# Altium schematic sheet Controller.SchDoc
size A4; SheetNumber: 3; SheetTotal: 5
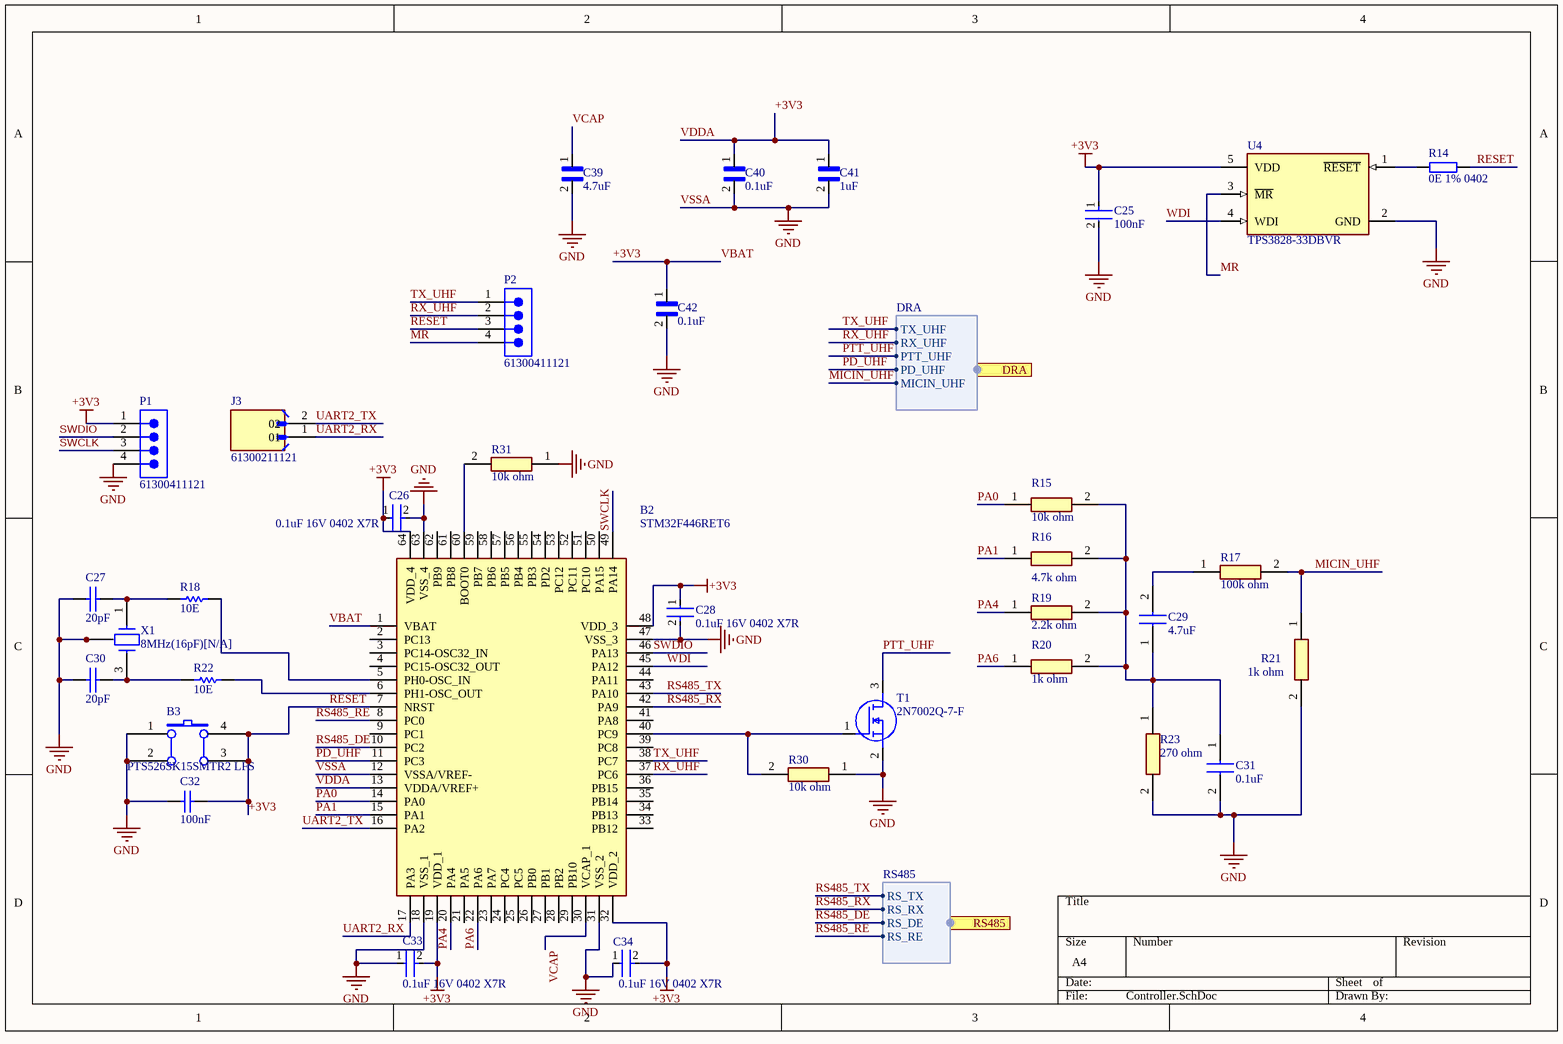
[diagram p0: Controller.SchDoc]

## Parts
B2  STM32F446RET6  [LQFP64]
B3  PTS526SK15SMTR2 LFS  [PTS526SK15SMTR2 LFS]
C25  100nF  [CAP0402S]
C26  0.1uF 16V 0402 X7R  [CAP0402S]
C27  20pF  [C0201]
C28  0.1uF 16V 0402 X7R  [CAP0402S]
C29  4.7uF  [CAP0603S]
C30  20pF  [C0201]
C31  0.1uF  [CAP0603S]
C32  100nF  [CAP0603S]
C33  0.1uF 16V 0402 X7R  [CAP0402S]
C34  0.1uF 16V 0402 X7R  [CAP0402S]
C39  4.7uF  [CAP0603S]
C40  0.1uF  [CAP0603S]
C41  1uF  [CAP0603S]
C42  0.1uF  [CAP0603S]
J3  61300211121  [HDR_P2.54_2X1_VERTICAL_TH]
P1  61300411121  [HDR_P2.0_4X1_VERTICAL_TH]
P2  61300411121  [HDR_P2.0_4X1_VERTICAL_TH]
R14  0E 1% 0402  [RES0402S]
R15  10k ohm  [RES0603S]
R16  4.7k ohm  [RES0603S]
R17  100k ohm  [RES0603S]
R18  10E  [RES0603S]
R19  2.2k ohm  [RES0603S]
R20  1k ohm  [RES0603S]
R21  1k ohm  [RES0603S]
R22  10E  [RES0603S]
R23  270 ohm  [RES0603S]
R30  10k ohm  [RES0603S]
R31  10k ohm  [RES0603S]
T1  2N7002Q-7-F  [SOT23_3]
U4  TPS3828-33DBVR  [SOT23-5]
X1  8MHz(16pF)[N/A]  [WE-XTAL_CFPX-104]

## Ports
DRA (harness DRA), RS485 (harness RS485)

## Harnesses
RS485: RS_TX, RS_RX, RS_DE, RS_RE
DRA: TX_UHF, RX_UHF, PTT_UHF, PD_UHF, MICIN_UHF

## Nets
+3V3: B2.1(VBAT) B2.7(NRST) B2.13(VDDA/VREF+) B2.19(VDD_1) B2.32(VDD_2) B2.48(VDD_3) B2.64(VDD_4) B3.3(B1) B3.4(A1) C25.1 C26.1 C28.1 C32.1 C33.2 C34.2 C40.1 C41.1 C42.1 P1.1 P2.3 R14.2 U4.5(VDD)  [also labelled RESET, VBAT, VDDA]
VSSA: B2.12(VSSA/VREF-) B2.18(VSS_1) B2.31(VSS_2) B2.47(VSS_3) B2.63(VSS_4) B3.1(A0) B3.2(B0) C25.2 C26.2 C27.2 C28.2 C30.2 C31.2 C32.2 C33.1 C34.1 C39.2 C40.2 C41.2 C42.2 P1.4 R21.2 R23.2 R30.1 R31.1 T1.2(S) U4.2(GND) X1.2 X1.4  [also labelled GND]
MICIN_UHF: R17.2 R21.1 ; port DRA.MICIN_UHF
MR: P2.4 U4.3(~{MR})
PA0: B2.14(PA0) R15.1
PA1: B2.15(PA1) R16.1
PA4: B2.20(PA4) R19.1
PA6: B2.22(PA6) R20.1
PD_UHF: B2.11(PC3) ; port DRA.PD_UHF
PTT_UHF: T1.3(D) ; port DRA.PTT_UHF
RS485_DE: B2.10(PC2) ; port RS485.RS_DE
RS485_RE: B2.8(PC0) ; port RS485.RS_RE
RS485_RX: B2.42(PA9) ; port RS485.RS_RX
RS485_TX: B2.43(PA10) ; port RS485.RS_TX
RX_UHF: B2.37(PC6) P2.2 ; port DRA.RX_UHF
SWCLK: B2.49(PA14) P1.3
SWDIO: B2.46(PA13) P1.2
TX_UHF: B2.38(PC7) P2.1 ; port DRA.TX_UHF
UART2_RX: B2.17(PA3) J3.1(01)
UART2_TX: B2.16(PA2) J3.2(02)
VCAP: B2.30(VCAP_1) C39.1
WDI: B2.45(PA12) U4.4(WDI)
NetB2_5: B2.5(PH0-OSC_IN) R18.1
NetB2_6: B2.6(PH1-OSC_OUT) R22.1
NetB2_40: B2.40(PC9) R30.2 T1.1(G)
NetB2_60: B2.60(BOOT0) R31.2
NetC27_1: C27.1 R18.2 X1.1
NetC29_1: C29.1 C31.1 R15.2 R16.2 R19.2 R20.2 R23.1
NetC29_2: C29.2 R17.1
NetC30_1: C30.1 R22.2 X1.3
NetR14_1: R14.1 U4.1(~{RESET})

Not connected (* = marked no-connect by the designer): B2 2(PC13) 3(PC14-OSC32_IN) 4(PC15-OSC32_OUT) 9(PC1) 21(PA5) 23(PA7) 24(PC4) 25(PC5) 26(PB0) 27(PB1) 28(PB2) 29(PB10) 33(PB12) 34(PB13) 35(PB14) 36(PB15) 39(PC8) 41(PA8) 44(PA11) 50(PA15) 51(PC10) 52(PC11) 53(PC12) 54(PD2) 55(PB3) 56(PB4) 57(PB5) 58(PB6) 59(PB7) 61(PB8) 62(PB9)

## Library data of the parts
B2 = STM32F446RET6: 32-Bit MCU+DSP 512K Flash 180MHz LQFP64 STMicroelectronics STM32F446RET6, 32bit ARM Cortex M4 MCU, 180MHz, 512 kB Flash, 64-Pin LQFP; Geometry.Height: 1.6mm; Mouser Part Number: 511-STM32F446RET6; Mouser Price/Stock: https://www.mouser.co.uk/ProductDetail/STMicroelectronics/STM32F446RET6?qs=Ok1pvOkw6%2FqpQsWf8F4wtQ%3D%3D; Manufacturer_Name: STMicroelectronics; Manufacturer_Part_Number: STM32F446RET6; Datasheet Link: https://datasheet.datasheetarchive.com/originals/distributors/DKDS41/DSANUWW0028583.pdf
B3 = SW PUSHBUTTON: SE PUSHBUTTON
C25 = b4654b650e69147ec39a6b967a45e02: CAP CER 0.1UF 10V X5R 0402; Manufacturer: Kemet; Manufacturer Part Number: C0402C104K8PACTU; Material: Ceramic; Capacitance: 0.10 μF; Temperature Coefficient: 15%; Tolerance: 0.1; Value: 0.10 μF; Package: C0402-BB; Temperature: -55°C to +125°C; ComponentLink2Description: Datasheet; Temperature Characteristic: X5R; Device Class L1: Passive Components; Height: 0.55mm; Lead Free: Yes; ComponentLink2URL: https://content.kemet.com/datasheets/KEM_C1002_X7R_SMD.pdf; Device Class L2: Capacitors; Temperature Range Low: -55°C; Temperature Range High: +125°C; RoHS: TRUE; Octopart: https://octopart.com/c0402c104k8pactu-kemet-140039; Automotive: No; Mouser Description: Capacitor 100 nF 10 VDC 0402; Category: Cap; Voltage Rating: 10 V; Digikey Description: CAP CER 0.1UF 10V X5R 0402; Ipc Land Pattern Name: CAPC10050X50; Device Class L3: Ceramic Capacitors
C26 C28 C33 C34 = 236180d848d6139a670b325ea6854c9: CAP CER 0.1UF 16V X7R 0402; Manufacturer Part Number: GRM155R71C104KA88D; Manufacturer: Murata; Standoff Height: 0mm; Tolerance: 10%; Voltage Rating: 16Vdc; Material: Ceramic; Capacitance: 0.10μF; Value: 0.10μF; RoHS: TRUE; Temperature Characteristic: X7R; Octopart: https://octopart.com/grm155r71c104ka88d-murata-196880; Digikey Description: CAP CER 0.1UF 16V X7R 0402; Device Class L3: Ceramic Capacitors; Height: 0.55mm; ComponentLink2Description: Datasheet; Temperature Range Low: -55°C; Ipc Land Pattern Name: CAPC10050X219; ComponentLink2URL: https://search.murata.co.jp/Ceramy/image/img/A01X/G101/ENG/GRM155R71H471KA01-01A.pdf; Device Class L1: Passive Components; Lead Free: yes; Category: Cap; Package: GRM15; Temperature: -55°C to +125°C; Device Class L2: Capacitors; Temperature Range High: +125°C; Mouser Description: 0402 0.1 uF 16V ±10 % Tolerance X7R SMT Multilayer Ceramic Capacitor
C27 C30 = CAP: Capacitor
C29 = GRM188R61E475KE11D: Capacitor; Manufacturer_Name: Murata Electronics; Datasheet Link: https://psearch.en.murata.com/capacitor/product/GRM188R61E475KE11%23.html; Height: 0.9mm; Manufacturer_Part_Number: GRM188R61E475KE11D; Mouser Part Number: 81-GRM188R61E475KE1D; Mouser Price/Stock: https://www.mouser.co.uk/ProductDetail/Murata-Electronics/GRM188R61E475KE11D?qs=eeBpzGFlv%252B9M0HqzMo%2FgYw%3D%3D; Arrow Part Number: GRM188R61E475KE11D; Arrow Price/Stock: https://www.arrow.com/en/products/grm188r61e475ke11d/murata-manufacturing?region=nac
C31 = C0603C104J5RACAUTO: Capacitor; Manufacturer_Name: KEMET; Datasheet Link: https://content.kemet.com/datasheets/KEM_C1023_X7R_AUTO_SMD.pdf; Height: 0.87mm; Manufacturer_Part_Number: C0603C104J5RACAUTO; Mouser Part Number: 80-C0603C104J5RAUTO; Mouser Price/Stock: https://www.mouser.co.uk/ProductDetail/KEMET/C0603C104J5RACAUTO?qs=XYJIsZbdjSO3ULwa1DwJaA%3D%3D; Arrow Part Number: C0603C104J5RACAUTO; Arrow Price/Stock: https://www.arrow.com/en/products/c0603c104j5racauto/kemet-corporation?region=europe
C32 = CAP: Capacitor; Value: 100pF; Published: 8-Jun-2000; Revision: July-2002: Re-released for DXP Platform.; Publisher: Altium Limited
C39-C42 = C0603C101J5GACTU: 100pF Â±5% 50V Ceramic Capacitor C0G, NP0 0603 _1608 Metric_; MF: KEMET; MP: C0603C101J5GACTU; SnapEDA_Link: https://www.snapeda.com/parts/C0603C101J5GACTU/KEMET/view-part/281849/?ref=snap; Availability: Unavailable; Package: 0603 Kemet; Value: *; Price: None
J3 = 61300211121: 2 pins, 1 row, straight, gold plating; MF: Wurth Electronics; SnapEDA_Link: https://www.snapeda.com/parts/61300211121/Wurth+Electronics/view-part/?ref=snap; Package: None; Value: *; MP: 61300211121; Check_prices: https://www.snapeda.com/parts/61300211121/Wurth+Electronics/view-part/?ref=eda
P1 P2 = CMP-1502-01064-3: NexarPartId: 32855522; Operating Supply Voltage: 250V; Pitch: 2.54mm; Contact Resistance: 20mΩ; Number of Positions: 4; Current Rating: 3A; Connector Type: Male Pin; Gender: Male; Contact Plating: Gold; Height: 8.89mm; Lead Pitch: 2.54mm; Lead Free: Lead Free; Contact Mating Length: 5.9944mm; Number of Rows: 1; Termination: Solder; Packaging: Bulk; REACH SVHC: Unknown; Min Operating Temperature: -40°C; RoHS: Compliant; Number of Contacts: 4; Voltage Rating: 250V; Color: Black; Max Operating Temperature: 105°C; Contact Material: Copper; Mount: Through Hole; Orientation: Vertical; Number of Pins: 4
R14 = RES_0402: Resistor SMD 0402; Manufacturer: *; Manufacturer Part Number: *; Distributor Link: *; LCSC: *
R15 R30 R31 = CRCW060310K0FKEA: Resistor; Manufacturer_Name: Vishay; Datasheet Link: http://www.vishay.com/docs/20035/dcrcwe3.pdf; Height: 0.5mm; Manufacturer_Part_Number: CRCW060310K0FKEA; Mouser Part Number: 71-CRCW0603-10K-E3; Mouser Price/Stock: https://www.mouser.co.uk/ProductDetail/Vishay-Dale/CRCW060310K0FKEA?qs=pAO1Z172M84BVnhDjtnsoQ%3D%3D; Arrow Part Number: CRCW060310K0FKEA; Arrow Price/Stock: https://www.arrow.com/en/products/crcw060310k0fkea/vishay?region=europe
R16 = CRCW06034K70FKEA: Resistor; Manufacturer_Name: Vishay; Datasheet Link: http://www.vishay.com/docs/20035/dcrcwe3.pdf; Height: 0.5mm; Manufacturer_Part_Number: CRCW06034K70FKEA; Mouser Part Number: 71-CRCW0603-4.7K-E3; Mouser Price/Stock: https://www.mouser.co.uk/ProductDetail/Vishay-Dale/CRCW06034K70FKEA?qs=4E3O%252BEEZcdLDG%2FSk4GmlWQ%3D%3D; Arrow Part Number: CRCW06034K70FKEA; Arrow Price/Stock: https://www.arrow.com/en/products/crcw06034k70fkea/vishay?region=nac
R17 = CRCW0603100KFKEA: Resistor; Manufacturer_Name: Vishay; Datasheet Link: http://www.vishay.com/docs/20035/dcrcwe3.pdf; Height: 0.5mm; Manufacturer_Part_Number: CRCW0603100KFKEA; Mouser Part Number: 71-CRCW0603-100K-E3; Mouser Price/Stock: https://www.mouser.co.uk/ProductDetail/Vishay-Dale/CRCW0603100KFKEA?qs=6dqgS%252BKntICWHMMdIzt5%2FQ%3D%3D; Arrow Part Number: CRCW0603100KFKEA; Arrow Price/Stock: https://www.arrow.com/en/products/crcw0603100kfkea/vishay?region=nac
R18 R22 = Res1: Resistor; Value: 1K; Published: 8-Jun-2000; Revision: July-2002: Re-released for DXP Platform.; Publisher: Altium Limited
R19 = CRCW06032K20JNEAHP: Resistor; Manufacturer_Name: Vishay; Datasheet Link: http://www.vishay.com/docs/20043/crcwhpe3.pdf; Height: 0.55mm; Manufacturer_Part_Number: CRCW06032K20JNEAHP; Mouser Part Number: 71-CRCW06032K20JNEAH; Mouser Price/Stock: https://www.mouser.co.uk/ProductDetail/Vishay-Dale/CRCW06032K20JNEAHP/?qs=k2%2FDWSARqgFWsVO90R5J%2FQ%3D%3D; Arrow Part Number: CRCW06032K20JNEAHP; Arrow Price/Stock: https://www.arrow.com/en/products/crcw06032k20jneahp/vishay
R20 R21 = CRCW06031K00FKEAHP: Resistor; Manufacturer_Name: Vishay; Datasheet Link: https://componentsearchengine.com/Datasheets/2/CRCW06031K00FKEAHP.pdf; Height: 0.55mm; Manufacturer_Part_Number: CRCW06031K00FKEAHP; Mouser Part Number: 71-CRCW06031K00FKEAH; Mouser Price/Stock: https://www.mouser.co.uk/ProductDetail/Vishay-Dale/CRCW06031K00FKEAHP?qs=FlFvgi4rxBx1%252B5DAse78lQ%3D%3D; Arrow Part Number: CRCW06031K00FKEAHP; Arrow Price/Stock: https://www.arrow.com/en/products/crcw06031k00fkeahp/vishay?region=nac
R23 = CRCW0603270RFKEA: Resistor; Manufacturer_Name: Vishay; Datasheet Link: http://www.vishay.com/docs/20035/dcrcwe3.pdf; Height: 0.5mm; Manufacturer_Part_Number: CRCW0603270RFKEA; Mouser Part Number: 71-CRCW0603-270-E3; Mouser Price/Stock: https://www.mouser.co.uk/ProductDetail/Vishay-Dale/CRCW0603270RFKEA?qs=pbofycSuseMg1CwiubILXA%3D%3D; Arrow Part Number: CRCW0603270RFKEA; Arrow Price/Stock: https://www.arrow.com/en/products/crcw0603270rfkea/vishay
T1 = 2N7000-G: MOSFET (N-Channel); Manufacturer_Name: Microchip; Datasheet Link: http://www.microchip.com/mymicrochip/filehandler.aspx?ddocname=en571380; Height: 5.334mm; Manufacturer_Part_Number: 2N7000-G; Mouser Part Number: 689-2N7000-G; Mouser Price/Stock: https://www.mouser.co.uk/ProductDetail/Microchip-Technology/2N7000-G?qs=yU2N9dt%252BrfnyR%2FOhNomgZw%3D%3D; Arrow Part Number: 2N7000-G; Arrow Price/Stock: https://www.arrow.com/en/products/2n7000-g/microchip-technology?region=nac
U4 = 340a9547a0ab8213f3a8fa70aee32e0: IC 2.93V SUPPLY MONITOR SOT23-5; Manufacturer Part Number: TPS3828-33DBVT; Manufacturer: Texas Instruments; Min Supply Voltage: 1.1V; Number Of Rails Monitored: 1; Max Supply Voltage: 5.5V; Reset Type: Active Low; Watchdog Timer: true; Nominal Supply Current: 15uA; Standoff Height: 0mm; Device Class L1: Integrated Circuits (ICs); Threshold Voltage: 2.93V; Ambient Temperature Range Low: -40°C; Temperature: -40°C to +85°C; Octopart: https://octopart.com/tps3828-33dbvt-texas+instruments-505920; Device Class L2: Power Management ICs; Lead Free: Yes; Height: 1.45mm; Mouser Description: Supervisory Circuits 2.93V Monitor; Automotive: No; ComponentLink2URL: http://www.ti.com/lit/ds/symlink/tps3828.pdf; Ambient Temperature Range High: +85°C; Digikey Description: IC 2.93V SUPPLY MONITOR SOT23-5; ComponentLink2Description: Datasheet; Category: IC; Package: DBV0005A; Temperature Range Low: -40°C; Device Class L3: Voltage Supervisors; Number Of Outputs: 1; RoHS: TRUE; Temperature Range High: +85°C
X1 = CRYSTAL